# EasyEDA Pro project ProDocument_Inexpensive_2023-07-23.epro

# Schematic Schematic1_2
Create Date: 2023-07-16; Page Name: P1; Project Name: 39CASTIC; Schematic Name: Schematic1_2; Update Date: 2023-07-19; Add into BOM: yes; Company: 深圳嘉立创科技发展有限公司; Convert to PCB: yes; Drawed: 嘉立创EDA; Page Size: A3; Part Number: JLCPCB-001; Reviewed: 嘉立创EDA; Version: V0.1
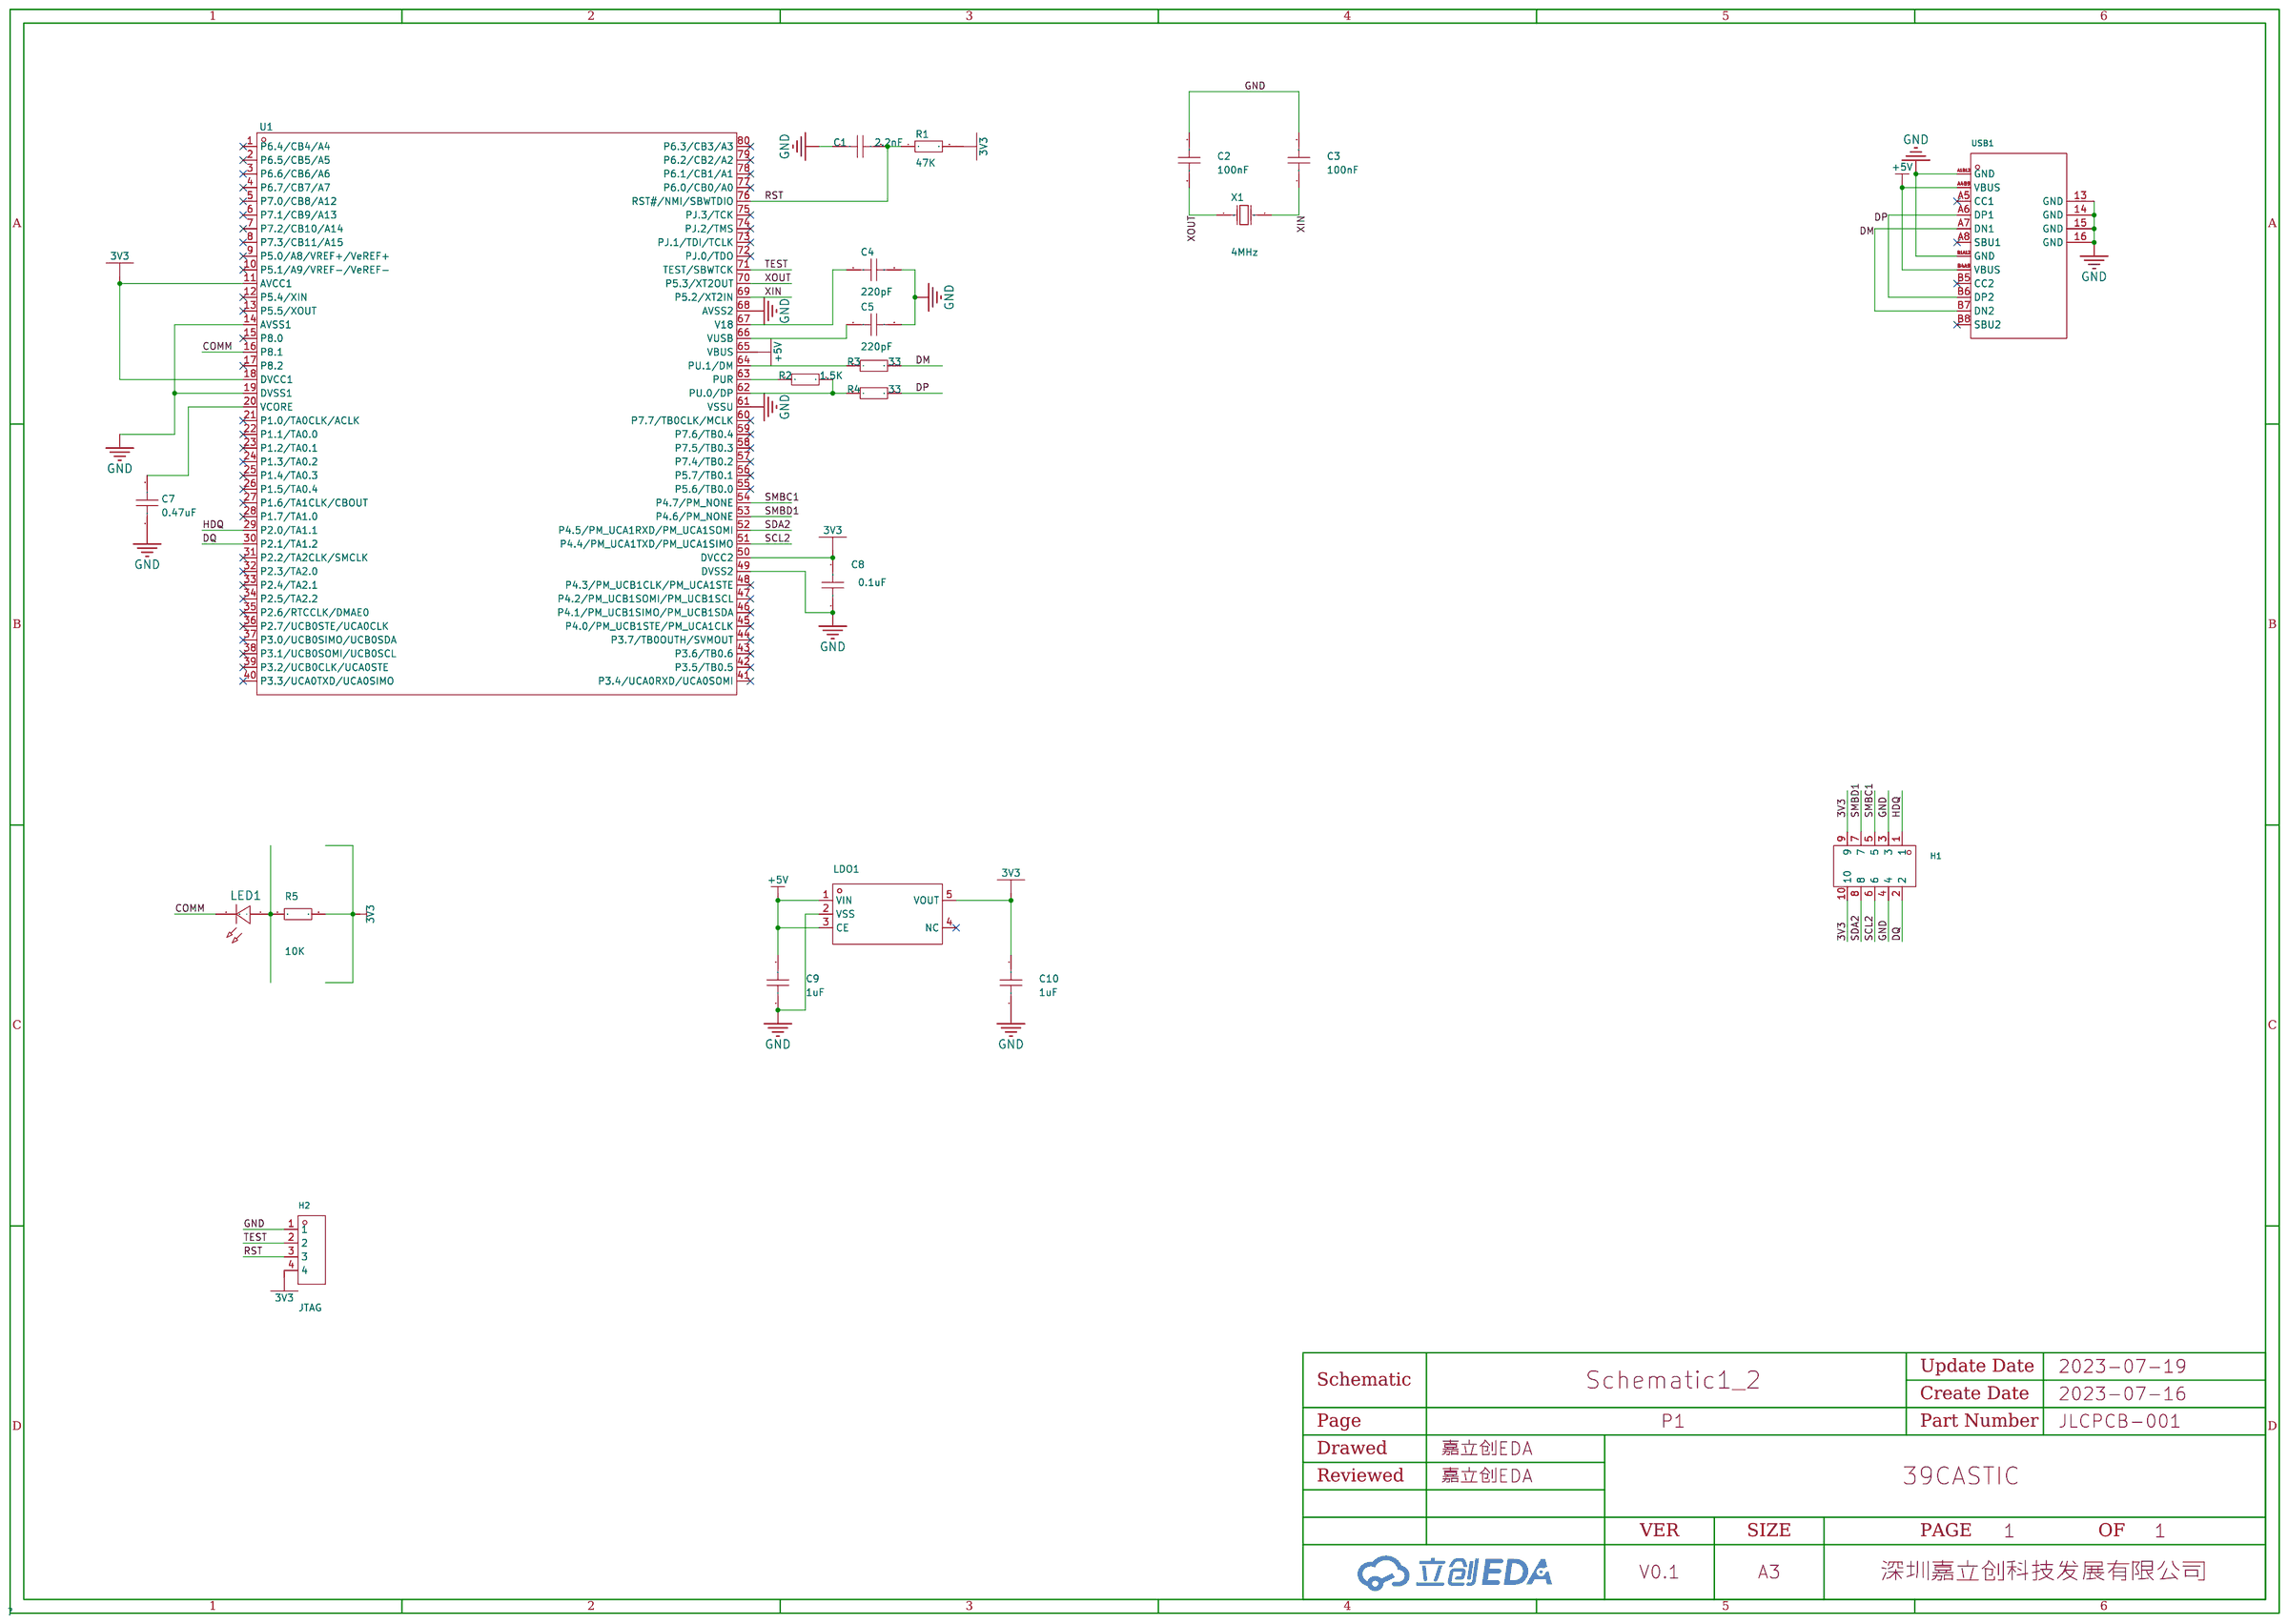
[diagram p0: schematic sheet]

## Parts
C1  2.2nF  [C0603_1]
C2  100nF  [C0603]
C3  100nF  [C0603]
C4  220pF  [C0603_1]
C5  220pF  [C0603_1]
C7  0.47uF  [C0603_1]
C8  0.1uF  [C0603_1]
C9  1uF  [C0603]
C10  1uF  [C0603]
H1  PZ254V-12-10P  [HDR-TH_10P-P2.54-V-M-R2-C5-S2.54]
H2  JTAG  [HDR-TH_4P-P2.54-V-F]
LDO1  ME6211C33M5G-N  [SOT-23-5_L3.0-W1.7-P0.95-LS2.8-BL]
LED1  -  [LED_0603]
R1  47K  [R0603_1]
R2  1.5K  [R0603_1]
R3  33  [R0603_1]
R4  33  [R0603_1]
R5  10K  [R0603]
U1  -  [LQFP-80_L12.0-W12.0-P0.50-LS14.0-BL]
USB1  TYPEC-304-BCP16  [USB-C-SMD_TYPEC-304-BCP16]
X1  4MHz  [HC-49US_L11.5-W4.5-P4.88]

## Library data of the parts
C1 C4 C5 C7 C8 = CAP_604: 容值:100nF;精度:±10%;额定电压:50V;温度系数:X7R;; Supplier Footprint: 0603
C2 C3 C9 C10 = CAP_0603: Supplier Footprint: 0603
H1 = PZ254V-12-10P: 排数:双排;总PIN位数:10;间距:2.54mm;插针结构:2x5P;行距:2.54mm;安装类型:直插;圆针/方针:方针;额定电流:-;额定电压:-;配合针长度:6mm;塑高:2.5mm;端接针长度:3mm;触头材质:黄铜;触头镀层:-;工作温度范围:-40℃~+105℃;颜色:黑色;; LCSC Part Name: 2.54mm 2x5P 直插 方针; Supplier Part: C492422; Manufacturer: XFCN(兴飞); Supplier Footprint: 直插,P=2.54mm; JLCPCB Part Class: 扩展库; Supplier: LCSC; Number of Rows: 双排; Number of Pins: 10; Pitch: 2.54mm; Pin Structure: 2x5P; Row Spacing: 2.54mm; Mounting Type: 直插; Circluar Pins/Square Pins: 方针; Length of Mating Pin: 6mm; Insulation Height: 2.5mm; Length of End Connection Pin: 3mm; Contact Material: 黄铜; Operating Temperature Range: -40℃~+105℃; Color: 黑色
H2 = HDR-F_2.54_1x4P: Supplier Part: C2718488; Supplier Footprint: 插件
LDO1 = ME6211C33M5G-N: 输出类型:固定;输出极性:正;最大输入电压:6V;输出电压:3.3V;输出电流:500mA;电源纹波抑制比(PSRR):70dB;; Supplier Part: C82942; Manufacturer: MICRONE(南京微盟); Supplier Footprint: SOT-23-5; JLCPCB Part Class: 扩展库; Datasheet: https://atta.szlcsc.com/upload/public/pdf/source/20170918/C82942_1505727073070976520.pdf; Supplier: LCSC; Output Type: 固定; Output Polarity: 正; Number of Outputs: 1; Maximum Input Voltage: 6V; Output Voltage: 3.3V; Dropout Voltage: 260mV@(200mA); Output Current: 500mA; Power Supply Rejection Ratio (PSRR): 70dB
LED1 = LED_0603-R: Supplier Footprint: 0603
R1-R4 = Res_604: Supplier Footprint: 0603
R5 = Res_0603: Supplier Footprint: 0603
U1 = MSP430F5529IPN: CPU位数:-;ROM类型:-;CPU内核:-;主频（MAX):-;工作电压:-;; Supplier Part: C75712; Manufacturer: TI(德州仪器); Supplier Footprint: LQFP-80; JLCPCB Part Class: Extended Part; Datasheet: https://atta.szlcsc.com/upload/public/pdf/source/20180528/C75712_042792AAA7951DA6306D06E7842A7EC0.pdf; Supplier: LCSC
USB1 = TYPEC-304-BCP16_C720629: 连接器类型:Type-C;标准:USB 3.1;公母:母座;触点数量:16;端口数量:1;安装方式:卧贴;额定电流 - 电源:3A;工作温度范围:-25℃~+85℃;焊接温度(最大值):260℃;; LCSC Part Name: Type-C 母座 卧贴 停产; Supplier Part: C720629; Manufacturer: XUNPU(讯普); Supplier Footprint: SMD; JLCPCB Part Class: Extended Part; Supplier: LCSC; Connector Type: Type-C; Standard: USB 3.1; Gender: 母座; Number of Contacts: 16; Number of Ports: 1; Mounting Style: 卧贴; Current Rating - Power (Max): 3A; Operating Temperature Range: -25℃~+85℃; Welding Temperature (Max): 260℃
X1 = X49SD4MSD2SC: 频率:4MHz;频率公差:±20ppm;负载电容:20pF;; LCSC Part Name: 4MHz ±20ppm 20pF HC-49US; Supplier Part: C13761; Manufacturer: YXC(扬兴晶振); Supplier Footprint: HC-49S; JLCPCB Part Class: 扩展库; Datasheet: https://atta.szlcsc.com/upload/public/pdf/source/20210903/A997D130AE99CBB55D9024F9BE6DA174.pdf; Supplier: LCSC; Crystal Type: 49S晶振; Frequency Tolerance: ±20ppm; Frequency Stability: ±30ppm; Load Capacitance: 20pF; Operating Temperature: -20℃~+70℃

## Nets
3V3: C8.2 C10.2 H1.9 H1.10 H2.4 LDO1.5(VOUT) R1.2 R5.2 U1.11(AVCC1) U1.18(DVCC1) U1.50(DVCC2)
+5V: C9.2 LDO1.1(VIN) LDO1.3(CE) U1.65(VBUS) USB1.A4B9(VBUS) USB1.B4A9(VBUS)
GND: C1.1 C2.2 C3.2 C4.2 C5.2 C7.1 C8.1 C9.1 C10.1 H1.3 H1.4 H2.1 LDO1.2(VSS) U1.14(AVSS1) U1.19(DVSS1) U1.49(DVSS2) U1.61(VSSU) U1.68(AVSS2) USB1.13(GND) USB1.14(GND) USB1.15(GND) USB1.16(GND) USB1.A1B12(GND) USB1.B1A12(GND)
COMM: LED1.1(C) U1.16(P8.1)
DM: R3.2 USB1.A7(DN1) USB1.B7(DN2)
DP: R4.2 USB1.A6(DP1) USB1.B6(DP2)
DQ: H1.2 U1.30(P2.1/TA1.2)
HDQ: H1.1 U1.29(P2.0/TA1.1)
RST: C1.2 H2.3 R1.1 U1.76(RST#/NMI/SBWTDIO)
SCL2: H1.6 U1.51(P4.4/PM_UCA1TXD/PM_UCA1SIMO)
SDA2: H1.8 U1.52(P4.5/PM_UCA1RXD/PM_UCA1SOMI)
SMBC1: H1.5 U1.54(P4.7/PM_NONE)
SMBD1: H1.7 U1.53(P4.6/PM_NONE)
TEST: H2.2 U1.71(TEST/SBWTCK)
XIN: C3.1 U1.69(P5.2/XT2IN) X1.1(OSC1)
XOUT: C2.1 U1.70(P5.3/XT2OUT) X1.2(OSC2)
$1N1515: C7.2 U1.20(VCORE)
$1N2214: R2.2 R4.1 U1.62(PU.0/DP)
$1N2405: R2.1 U1.63(PUR)
$1N2629: R3.1 U1.64(PU.1/DM)
$1N2974: C5.1 U1.66(VUSB)
$1N2990: C4.1 U1.67(V18)
$1N11086: LED1.2(A) R5.1

Not connected (* = marked no-connect by the designer): LDO1 4(NC)*; U1 1(P6.4/CB4/A4)* 2(P6.5/CB5/A5)* 3(P6.6/CB6/A6)* 4(P6.7/CB7/A7)* 5(P7.0/CB8/A12)* 6(P7.1/CB9/A13)* 7(P7.2/CB10/A14)* 8(P7.3/CB11/A15)* 9(P5.0/A8/VREF+/VeREF+)* 10(P5.1/A9/VREF-/VeREF-)* 12(P5.4/XIN)* 13(P5.5/XOUT)* 15(P8.0)* 17(P8.2)* 21(P1.0/TA0CLK/ACLK)* 22(P1.1/TA0.0)* 23(P1.2/TA0.1)* 24(P1.3/TA0.2)* 25(P1.4/TA0.3)* 26(P1.5/TA0.4)* 27(P1.6/TA1CLK/CBOUT)* 28(P1.7/TA1.0)* 31(P2.2/TA2CLK/SMCLK)* 32(P2.3/TA2.0)* 33(P2.4/TA2.1)* 34(P2.5/TA2.2)* 35(P2.6/RTCCLK/DMAE0)* 36(P2.7/UCB0STE/UCA0CLK)* 37(P3.0/UCB0SIMO/UCB0SDA)* 38(P3.1/UCB0SOMI/UCB0SCL)* 39(P3.2/UCB0CLK/UCA0STE)* 40(P3.3/UCA0TXD/UCA0SIMO)* 41(P3.4/UCA0RXD/UCA0SOMI)* 42(P3.5/TB0.5)* 43(P3.6/TB0.6)* 44(P3.7/TB0OUTH/SVMOUT)* 45(P4.0/PM_UCB1STE/PM_UCA1CLK)* 46(P4.1/PM_UCB1SIMO/PM_UCB1SDA)* 47(P4.2/PM_UCB1SOMI/PM_UCB1SCL)* 48(P4.3/PM_UCB1CLK/PM_UCA1STE)* 55(P5.6/TB0.0)* 56(P5.7/TB0.1)* 57(P7.4/TB0.2)* 58(P7.5/TB0.3)* 59(P7.6/TB0.4)* 60(P7.7/TB0CLK/MCLK)* 72(PJ.0/TDO)* 73(PJ.1/TDI/TCLK)* 74(PJ.2/TMS)* 75(PJ.3/TCK)* 77(P6.0/CB0/A0)* 78(P6.1/CB1/A1)* 79(P6.2/CB2/A2)* 80(P6.3/CB3/A3)*; USB1 A5(CC1)* A8(SBU1)* B5(CC2)* B8(SBU2)*

# Board PCB1_2
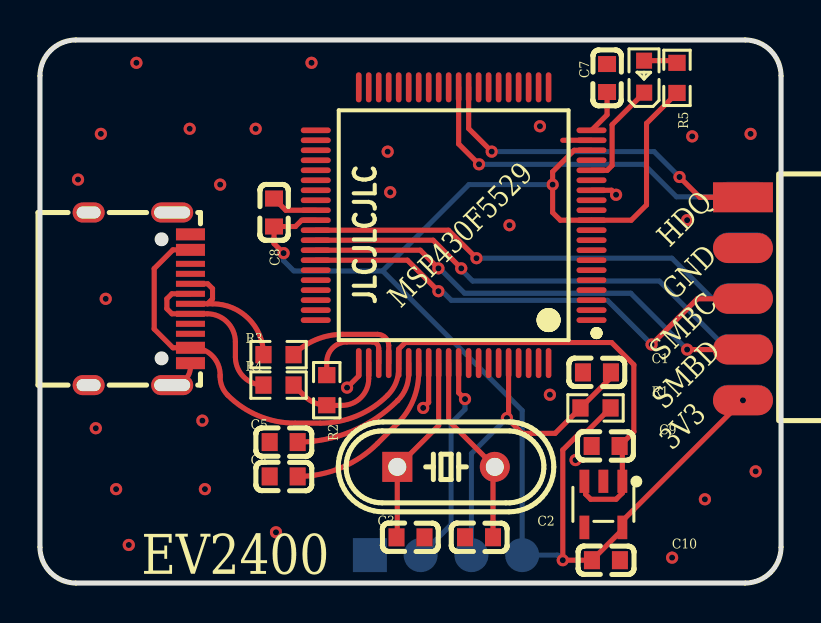
[diagram p1: board, top side]
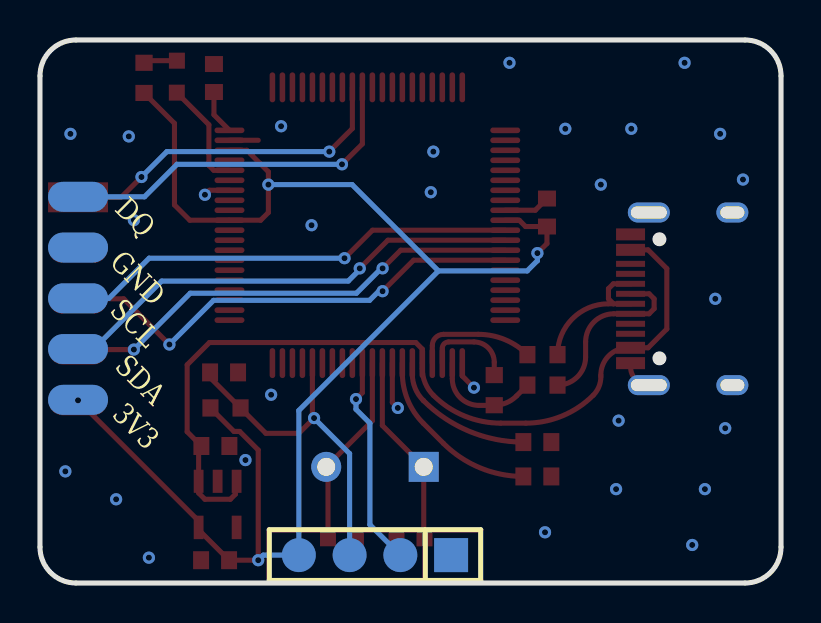
[diagram p2: board, bottom side, seen from below]

Outline 37.08 x 27.18 mm; copper layers: Top Layer, Bottom Layer. Coordinates in mm from the lower left corner of the outline.
Outline path: 0,25.38 0,1.8 arc(0.53,0.53) 1.8,0 35.28,0 arc(36.56,0.53) 37.08,1.8 37.08,25.38 arc(36.56,26.65) 35.28,27.18 1.8,27.18 arc(0.53,26.65) 0,25.38
Stack: Top Layer 0.035mm / Dielectric1 1.51mm FR4 er 4.5 / Bottom Layer 0.035mm

## Design rules (mm)
net DP: DP2
net DM: DP2
template: JLCPCB Capability(Two Layers Board)
spacing copperThickness1oz (default): track to track 0.102, other pairs 0.152 to 0.3
spacing copperThickness2oz: track to track 0.203, other pairs 0.152 to 0.3
track width copperThickness1oz (default): min 0.127, default 0.254, max 2.54
track width copperThickness2oz: min 0.203, default 0.254, max 2.54
differential pair differentialPair (default): width min 0.127, default 0.254, max 2.54; gap min 0.152, default 0.152
via viaSize (default): diameter min 0.5, default 0.61, max 10; hole min 0.3, default 0.305, max 6.3

## Placement (name value [footprint] x y rotation side)
C1  2.2nF  [C0603_1]  27.87 10.54 0 top
C2  100nF  [C0603]  21.97 2.29 180 top
C3  100nF  [C0603]  18.54 2.29 0 top
C4  220pF  [C0603_1]  12.19 5.33 180 top
C5  220pF  [C0603_1]  12.19 7.05 180 top
C7  0.47uF  [C0603_1]  28.38 25.27 270 top
C8  0.1uF  [C0603_1]  11.71 18.54 270 top
C9  1uF  [C0603]  28.31 6.86 0 top
C10  1uF  [C0603]  28.32 1.14 180 top
H1  PZ254V-12-10P  [HDR-TH_10P-P2.54-V-M-R2-C5-S2.54]  36.45 14.22 270 top
H2  JTAG  [HDR-TH_4P-P2.54-V-F]  20.32 1.4 0 bottom
LDO1  ME6211C33M5G-N  [SOT-23-5_L3.0-W1.7-P0.95-LS2.8-BL]  28.19 3.94 180 top
LED1  -  [LED_0603]  30.23 25.39 90 top
R1  47K  [R0603_1]  27.8 8.76 0 top
R2  1.5K  [R0603_1]  14.35 9.65 270 top
R3  33  [R0603_1]  11.94 11.43 180 top
R4  33  [R0603_1]  11.94 9.91 180 top
R5  10K  [R0603]  31.88 25.28 270 top
U1  -  [LQFP-80_L12.0-W12.0-P0.50-LS14.0-BL]  20.7 17.91 90 top
USB1  TYPEC-304-BCP16  [USB-C-SMD_TYPEC-304-BCP16]  4.98 14.22 270 top
X1  4MHz  [HC-49US_L11.5-W4.5-P4.88]  20.32 5.81 0 top

## Footprints (pads in the part's own frame, mm; a bottom-side part is the same pattern mirrored in y, then rotated)
C0603
  rect 0.8x0.9 smd: 1(-0.7,0) 2(0.7,0)
C0603_1
  rect 0.8x0.9 smd: 1(-0.7,0) 2(0.7,0)
HC-49US_L11.5-W4.5-P4.88
  rect 1.5x1.5 hole 0.9: 1(-2.44,0)
  round 1.5 hole 0.9: 2(2.44,0)
HDR-TH_4P-P2.54-V-F
  rect 1.7x1.7 smd: 1(-3.81,0)
  round 1.7 smd: 2(-1.27,0) 3(1.27,0) 4(3.81,0)
HDR-TH_10P-P2.54-V-M-R2-C5-S2.54
  rect 1.5x3 smd: 1(-5.08,-1.27)
  oval 1.5x3 smd far side: 2(-5.106,-1.27) 4(-2.566,-1.27) 6(-0.025,-1.27) 8(2.514,-1.27) 10(5.054,-1.27)
  oval 1.5x3 smd: 3(-2.54,-1.27) 5(0,-1.27) 7(2.54,-1.27) 9(5.08,-1.27)
LED_0603
  rect 0.8x0.8 smd: 1(-0.851,-0.01) 2(0.75,-0.005)
LQFP-80_L12.0-W12.0-P0.50-LS14.0-BL
  oval 0.28x1.5 smd: 1(-4.75,-6.9) 2(-4.25,-6.9) 3(-3.75,-6.9) 4(-3.25,-6.9) 5(-2.75,-6.9) 6(-2.25,-6.9) 7(-1.75,-6.9) 8(-1.25,-6.9) 9(-0.75,-6.9) 10(-0.25,-6.9) 11(0.25,-6.9) 12(0.75,-6.9) 13(1.25,-6.9) 14(1.75,-6.9) 15(2.25,-6.9) 16(2.75,-6.9) 17(3.25,-6.9) 18(3.75,-6.9) 19(4.25,-6.9) 20(4.75,-6.9) 41(4.75,6.9) 42(4.25,6.9) 43(3.75,6.9) 44(3.25,6.9) 45(2.75,6.9) 46(2.25,6.9) 47(1.75,6.9) 48(1.25,6.9) 49(0.75,6.9) 50(0.25,6.9) 51(-0.25,6.9) 52(-0.75,6.9) 53(-1.25,6.9) 54(-1.75,6.9) 55(-2.25,6.9) 56(-2.75,6.9) 57(-3.25,6.9) 58(-3.75,6.9) 59(-4.25,6.9) 60(-4.75,6.9)
  oval 1.5x0.28 smd: 21(6.9,-4.75) 22(6.9,-4.25) 23(6.9,-3.75) 24(6.9,-3.25) 25(6.9,-2.75) 26(6.9,-2.25) 27(6.9,-1.75) 28(6.9,-1.25) 29(6.9,-0.75) 30(6.9,-0.25) 31(6.9,0.25) 32(6.9,0.75) 33(6.9,1.25) 34(6.9,1.75) 35(6.9,2.25) 36(6.9,2.75) 37(6.9,3.25) 38(6.9,3.75) 39(6.9,4.25) 40(6.9,4.75) 61(-6.9,4.75) 62(-6.9,4.25) 63(-6.9,3.75) 64(-6.9,3.25) 65(-6.9,2.75) 66(-6.9,2.25) 67(-6.9,1.75) 68(-6.9,1.25) 69(-6.9,0.75) 70(-6.9,0.25) 71(-6.9,-0.25) 72(-6.9,-0.75) 73(-6.9,-1.25) 74(-6.9,-1.75) 75(-6.9,-2.25) 76(-6.9,-2.75) 77(-6.9,-3.25) 78(-6.9,-3.75) 79(-6.9,-4.25) 80(-6.9,-4.75)
R0603
  rect 0.806x0.864 smd: 1(-0.753,0) 2(0.753,0)
R0603_1
  rect 0.806x0.864 smd: 1(-0.753,0) 2(0.753,0)
SOT-23-5_L3.0-W1.7-P0.95-LS2.8-BL
  rect 0.49x1.157 smd: 1(-0.95,-1.153) 2(0,-1.153) 3(0.95,-1.153)
  rect 0.49x1.175 smd: 4(0.95,1.153) 5(-0.95,1.153)
USB-C-SMD_TYPEC-304-BCP16
  oval 1x2.1 hole 0.6x1.8: 13(-4.32,1.633) 14(4.32,1.633)
  oval 1x1.6 hole 0.6x1.2: 15(-4.32,-2.547) 16(4.32,-2.547)
  rect 0.6x1.45 smd: A1B12(-3.225,2.547) A4B9(-2.45,2.547) B1A12(3.22,2.547) B4A9(2.45,2.547)
  rect 0.3x1.45 smd: A5(-1.25,2.547) A6(-0.25,2.547) A7(0.25,2.547) A8(1.25,2.547) B5(1.75,2.547) B6(0.75,2.547) B7(-0.75,2.547) B8(-1.75,2.547)

## Nets
As in the schematic.

Pads without a net: LDO1 4; U1 1 2 3 4 5 6 7 8 9 10 12 13 15 17 21 22 23 24 25 26 27 28 31 32 33 34 35 36 37 38 39 40 41 42 43 44 45 46 47 48 55 56 57 58 59 60 72 73 74 75 77 78 79 80; USB1 A5 A8 B5 B8

## Via types
v1: diameter 0.61, hole 0.305, Top Layer to Bottom Layer, 44 vias

## Routing (per net, layer and track width the routed paths; a pad name or vN(x,y) marks a point on that pad's centre or on a via; arc(x,y) is an arc through that point)
3V3: length 76.1
  Top Layer w0.254: v1(12.19,16.51) 11.71,16.99 C8.2 12.78,17.84 13.1,18.16 U1.50 ; v1(35.18,9.14) 29.14,3.11 LDO1.5 29.14,2.67 C10.2 v1(26.16,1.14) 26.16,6.66 27.09,7.59 27.38,7.59 R1.2 ; U1.18 26.73,21.66 25.65,20.58 v1(25.65,19.94) 25.65,18.54 26.04,18.16 U1.11 29.59,18.16 30.35,18.92 30.35,23 R5.2
  Bottom Layer w0.254: 17.15,15.62 12.7,15.62 12.19,16.13 v1(12.19,16.51) ; 17.15,15.62 21.46,19.94 v1(25.65,19.94) ; 17.15,15.62 24.13,8.64 H2.4 25.91,1.4 v1(26.16,1.14)
+5V: length 43.9
  Top Layer w0.254: 27.24,5.09 27.31,5.03 27.31,4.45 27.56,4.19 28.83,4.19 29.14,4.51 LDO1.1 29.14,6.72 C9.2 29.72,7.57 29.72,10.92 28.6,12.04 18.28,12.04 17.95,11.71 U1.65 17.95,10.73 arc(17.81,10.01) 17.4,9.4 arc(15.85,8.36) 14.03,8 12.77,8 arc(10.95,8.36) 9.4,9.4 arc(9.12,9.82) 9.02,10.32 9.02,10.41 arc(8.62,11.38) 7.66,11.77 USB1.B4A9 6.65,11.77 5.72,12.71 5.72,15.74 6.65,16.67 USB1.A4B9
GND: length 10.5
  Top Layer w0.254: U1.68 19.45,9.04 v1(19.18,8.76) ; U1.49 12.3,18.66 C8.1 ; U1.61 15.95,10.36 v1(15.37,9.78) ; U1.19 26.16,22.16 ; v1(28.83,19.43) 28.6,19.66 U1.14 ; USB1.B1A12 7.53,10.82 arc(7.26,10.17) USB1.14
  vias: v1(1.91,20.19) v1(2.79,7.75) v1(3.05,22.48) v1(3.29,14.22) v1(3.81,4.7) v1(4.44,1.91) v1(4.83,26.04) v1(7.49,22.73) v1(8.13,8.13) v1(8.25,4.7) v1(9.02,19.94) v1(10.8,22.73) v1(11.81,2.54) v1(13.59,26.04) v1(17.4,21.59) v1(17.53,19.56) v1(23.49,17.91) v1(25.02,22.86) v1(25.52,9.42) v1(26.8,6.15) v1(31.63,1.27) v1(32.38,18.16) v1(32.64,22.35) v1(33.27,4.19) v1(35.56,22.48) v1(35.81,5.59)
COMM: length 5.4
  Top Layer w0.254: U1.16 28.39,20.66 28.63,20.9 28.63,22.94 LED1.1
DM: length 7.2
  Top Layer w0.254: 8.39,13.97 8.64,14.22 8.64,14.73 8.39,14.97 USB1.B7 ; 8.39,13.97 USB1.A7 ; 8.39,13.97 8.64,13.97 arc(10.44,13.23) R3.2
DP: length 9.1
  Top Layer w0.254: USB1.A6 6.6,14.47 6.35,14.22 6.35,13.73 6.6,13.47 USB1.B6 8.37,13.47 arc(9.37,13.06) 9.78,12.06 9.78,11.31 arc(10.19,10.32) R4.2
DQ: length 18.3
  Top Layer w0.254: v1(21.97,20.95) 20.95,21.98 U1.30
  Bottom Layer w0.254: 35.31,19.33 31.85,19.33 30.23,20.95 v1(21.97,20.95)
HDQ: length 17.3
  Top Layer w0.254: v1(32,20.32) 33.02,19.3 35.31,19.3 ; U1.29 21.45,22.75 v1(22.61,21.59)
  Bottom Layer w0.254: v1(32,20.32) 30.73,21.59 v1(22.61,21.59)
RST: length 17.3
  Top Layer w0.254: U1.76 23.45,8.34 v1(23.37,8.26) 24.13,7.49 25.78,7.49 27.05,8.76 ; 27.05,8.76 R1.1 ; 27.05,8.76 28.57,10.28 C1.2
  Bottom Layer w0.254: v1(23.37,8.26) 21.59,6.48 H2.3
SCL2: length 22.9
  Top Layer w0.254: v1(21.84,16.26) 20.44,17.66 U1.51
  Bottom Layer w0.254: v1(21.84,16.26) 31.62,16.26 33.63,14.25 35.31,14.25
SDA2: length 23.8
  Top Layer w0.254: v1(21.08,15.75) 19.67,17.16 U1.52
  Bottom Layer w0.254: 35.31,11.71 34.4,11.71 30.99,15.11 21.65,15.11 21.08,15.68 v1(21.08,15.75)
SMBC1: length 24.2
  Top Layer w0.254: 35.31,14.22 32.89,14.22 v1(30.61,11.94) ; v1(19.94,14.61) 18.39,16.16 U1.54
  Bottom Layer w0.254: v1(30.61,11.94) 28.4,14.15 20.59,14.15 20.13,14.61 v1(19.94,14.61)
SMBD1: length 23.6
  Top Layer w0.254: 35.31,11.68 v1(32.38,11.68) ; U1.53 19.03,16.66 v1(19.94,15.75)
  Bottom Layer w0.254: v1(19.94,15.75) 20,15.75 21.25,14.5 29.57,14.5 v1(32.38,11.68)
TEST: length 10.7
  Top Layer w0.254: v1(21.27,9.2) 20.95,9.52 U1.71
  Bottom Layer w0.254: v1(21.27,9.2) 21.27,8.7 20.57,8 20.57,2.92 19.05,1.4
XIN: length 9.6
  Top Layer w0.254: U1.69 19.95,7.88 X1.1 17.88,2.32 C3.1
XOUT: length 9.7
  Top Layer w0.254: U1.70 20.45,8.12 X1.2 22.67,5.72 C2.1
$1N1515: length 2.2
  Top Layer w0.254: U1.20 28.38,23.43 C7.2
$1N2214: length 5.7
  Top Layer w0.254: U1.62 16.45,10.23 arc(16.06,9.28) 15.11,8.89 14.36,8.89 arc(14.35,8.89) R2.2 arc(13.75,9.02) 13.24,9.36 R4.1
$1N2405: length 4.7
  Top Layer w0.254: U1.63 16.95,11.75 arc(16.86,11.97) 16.64,12.06 15.37,12.06 arc(14.65,11.77) 14.35,11.05 R2.1
$1N2629: length 6.2
  Top Layer w0.254: U1.64 17.45,11.89 arc(17.29,12.28) 16.89,12.45 15.14,12.45 arc(13.82,12.18) R3.1
$1N2974: length 7.6
  Top Layer w0.254: U1.66 18.45,10.46 arc(18.31,9.75) 17.91,9.14 17.88,9.12 arc(15.59,7.59) C5.1
$1N2990: length 9.2
  Top Layer w0.254: U1.67 18.95,10.52 arc(18.68,9.16) 17.91,8 16.9,6.99 arc(15.06,5.76) C4.1
$1N11086: length 1.7
  Top Layer w0.254: LED1.2 31.77,26.14 R5.1

## Copper pours and planes (outline as drawn; the poured copper is in the pictures)
GND on Top Layer: -5.59,31.37 48.13,31.37 48.13,-3.17 -5.59,-3.17
GND on Bottom Layer: -5.02,33.02 48.7,33.02 48.7,-1.52 -5.02,-1.52

## Text on the board
Bottom Silkscreen Layer: DQ | SDA | 3V3 | GND | SCL
Top Silkscreen Layer: JLCJLCJLC | MSP430F5529 | SMBC | SMBD | HDQ | 3V3 | GND | EV2400
